# Altium schematic sheet POWER.schdoc
size D; SheetNumber: 8; SheetTotal: 8
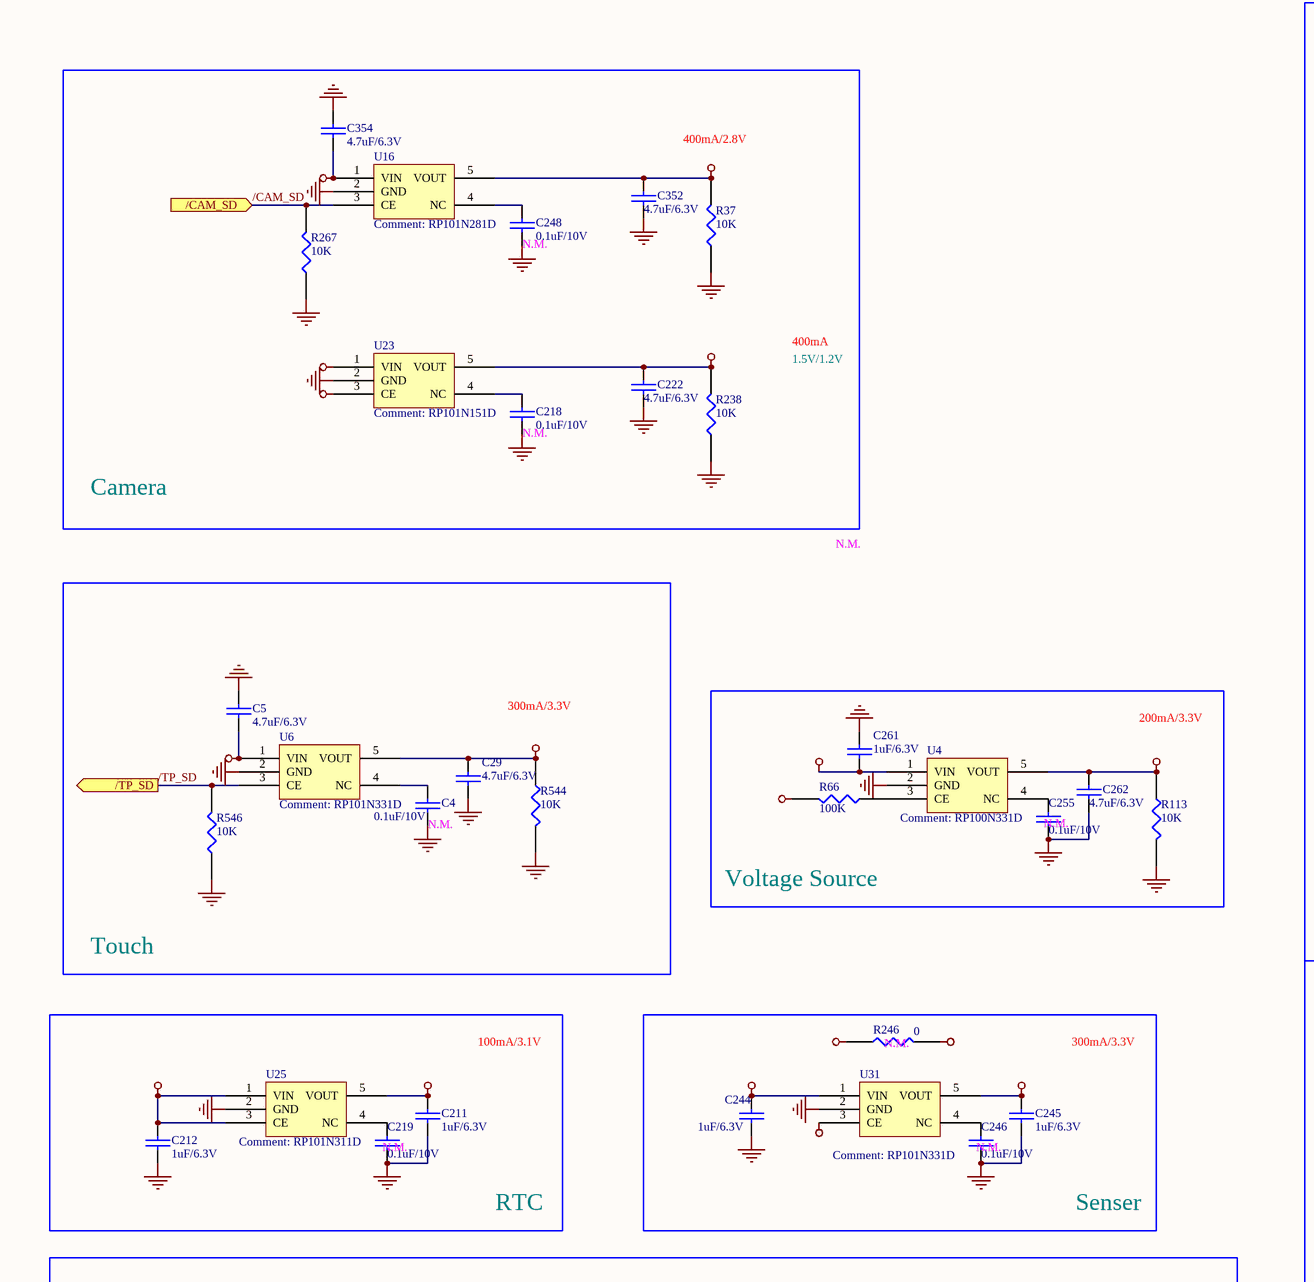
[diagram p0: POWER.schdoc, top left]
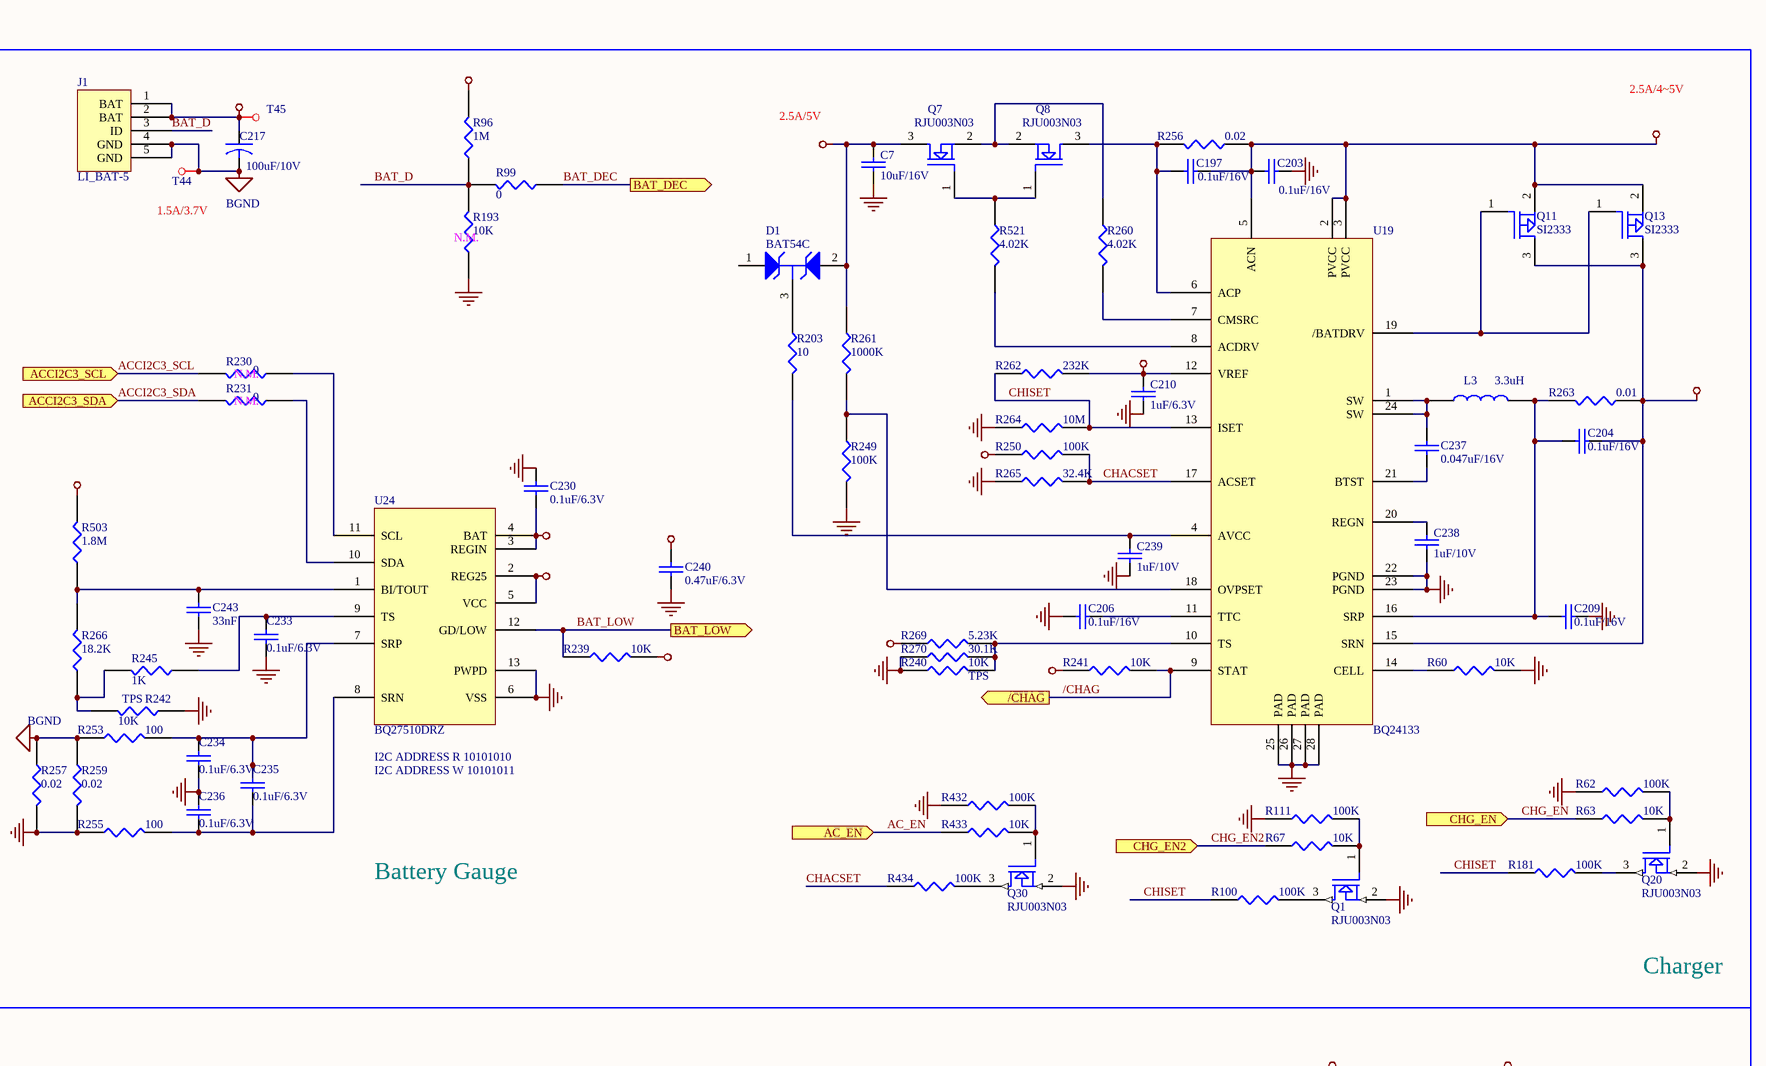
[diagram p1: POWER.schdoc, top middle]
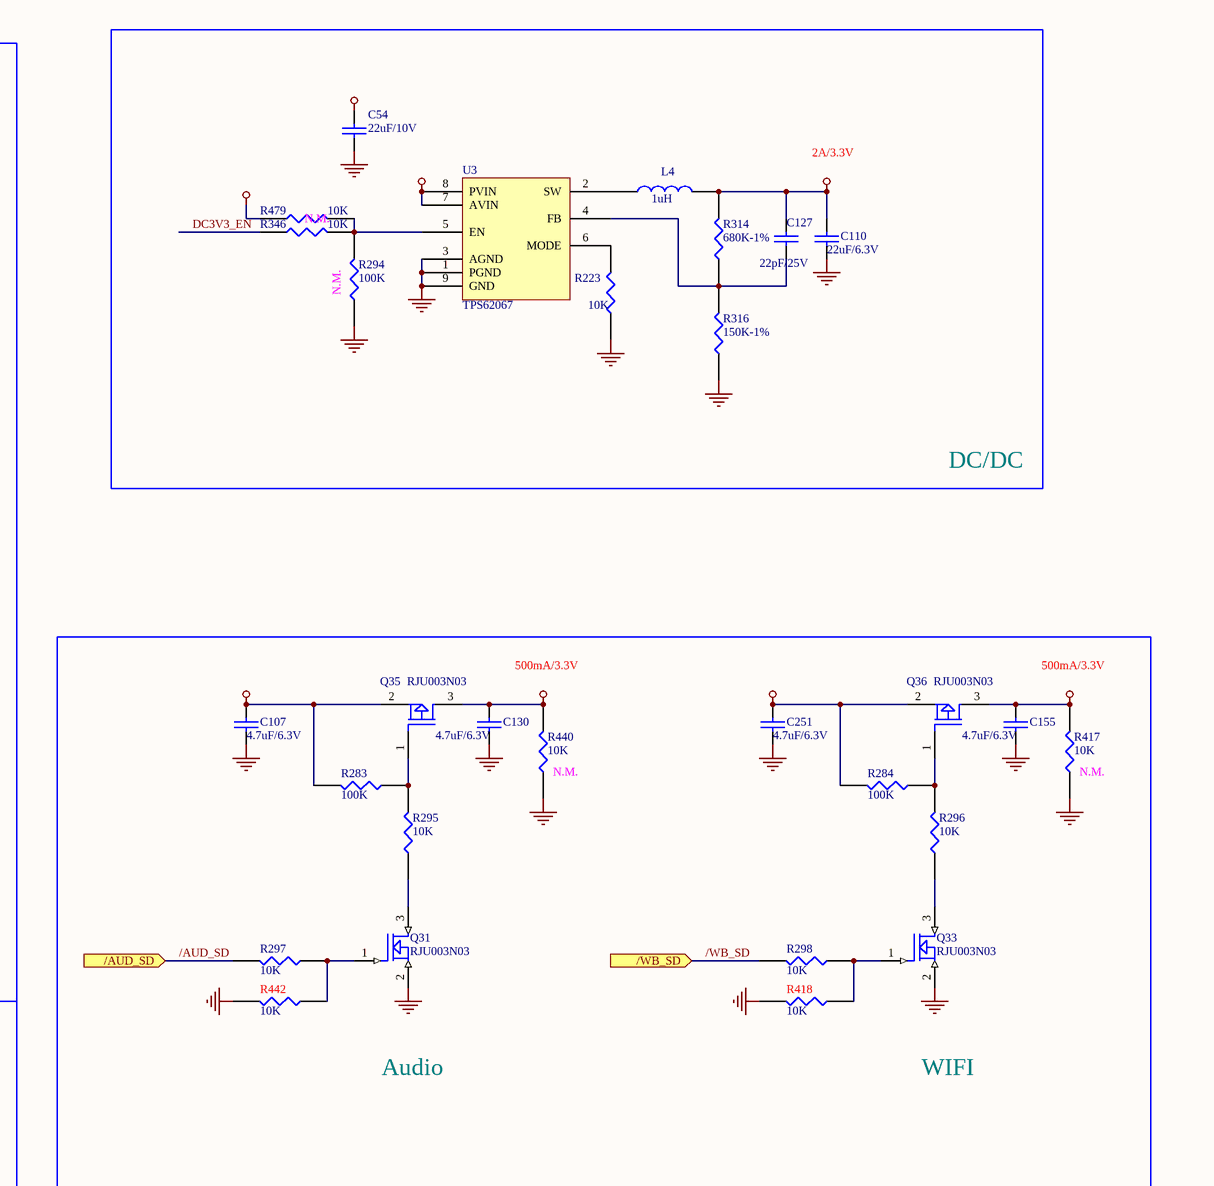
[diagram p2: POWER.schdoc, top right]
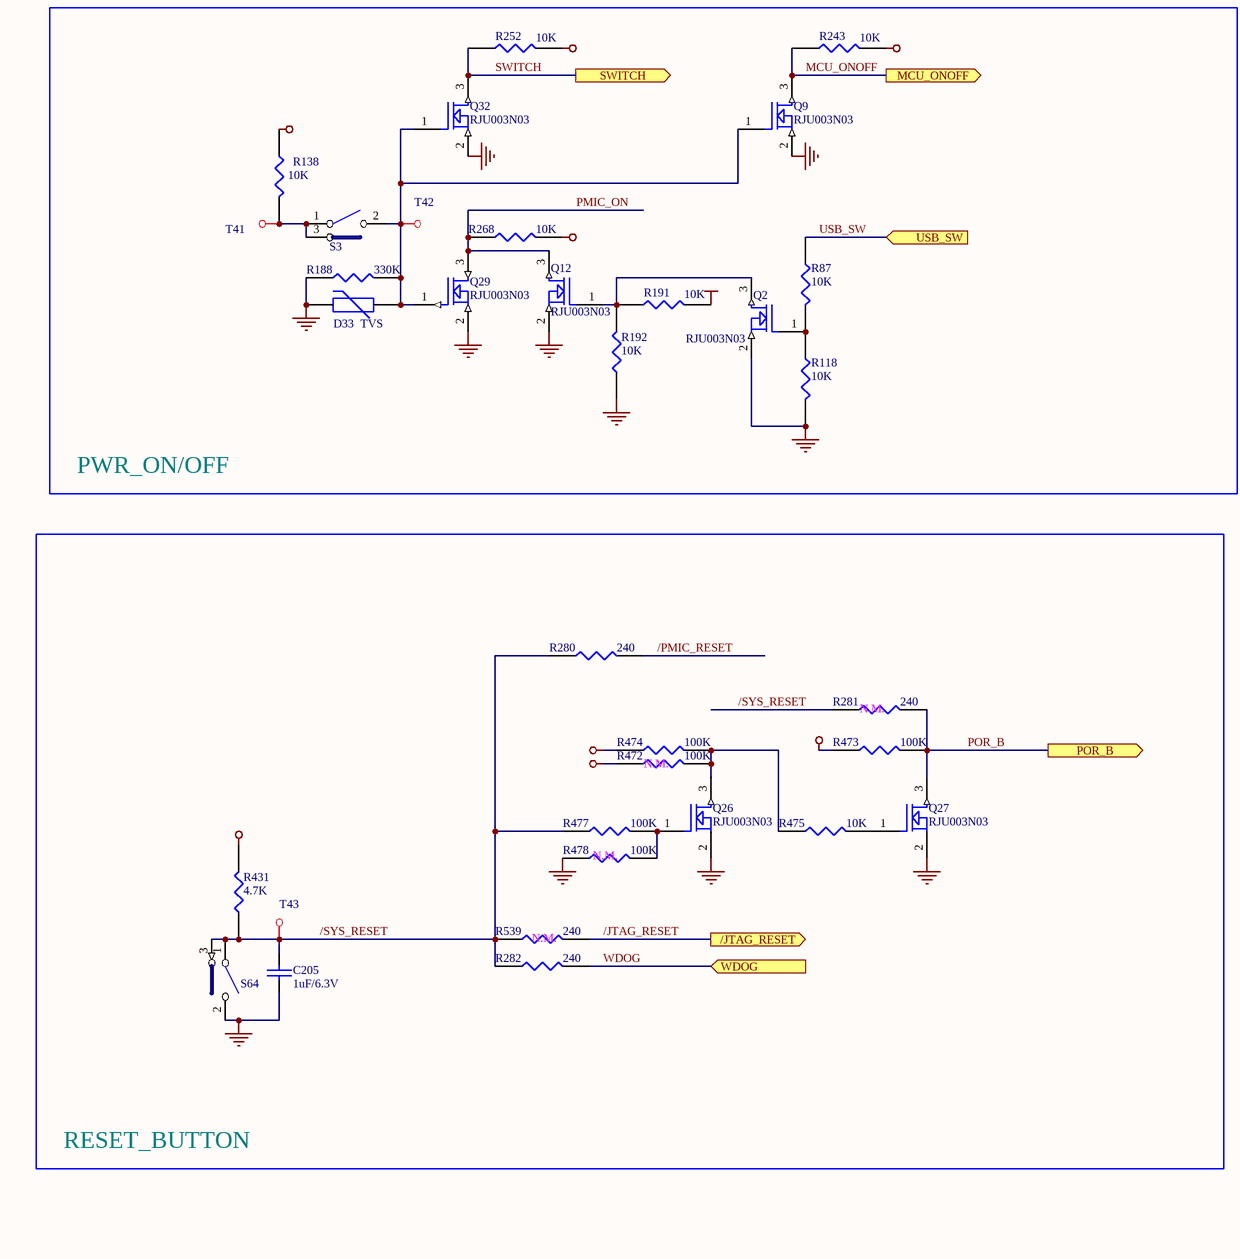
[diagram p3: POWER.schdoc, bottom left]
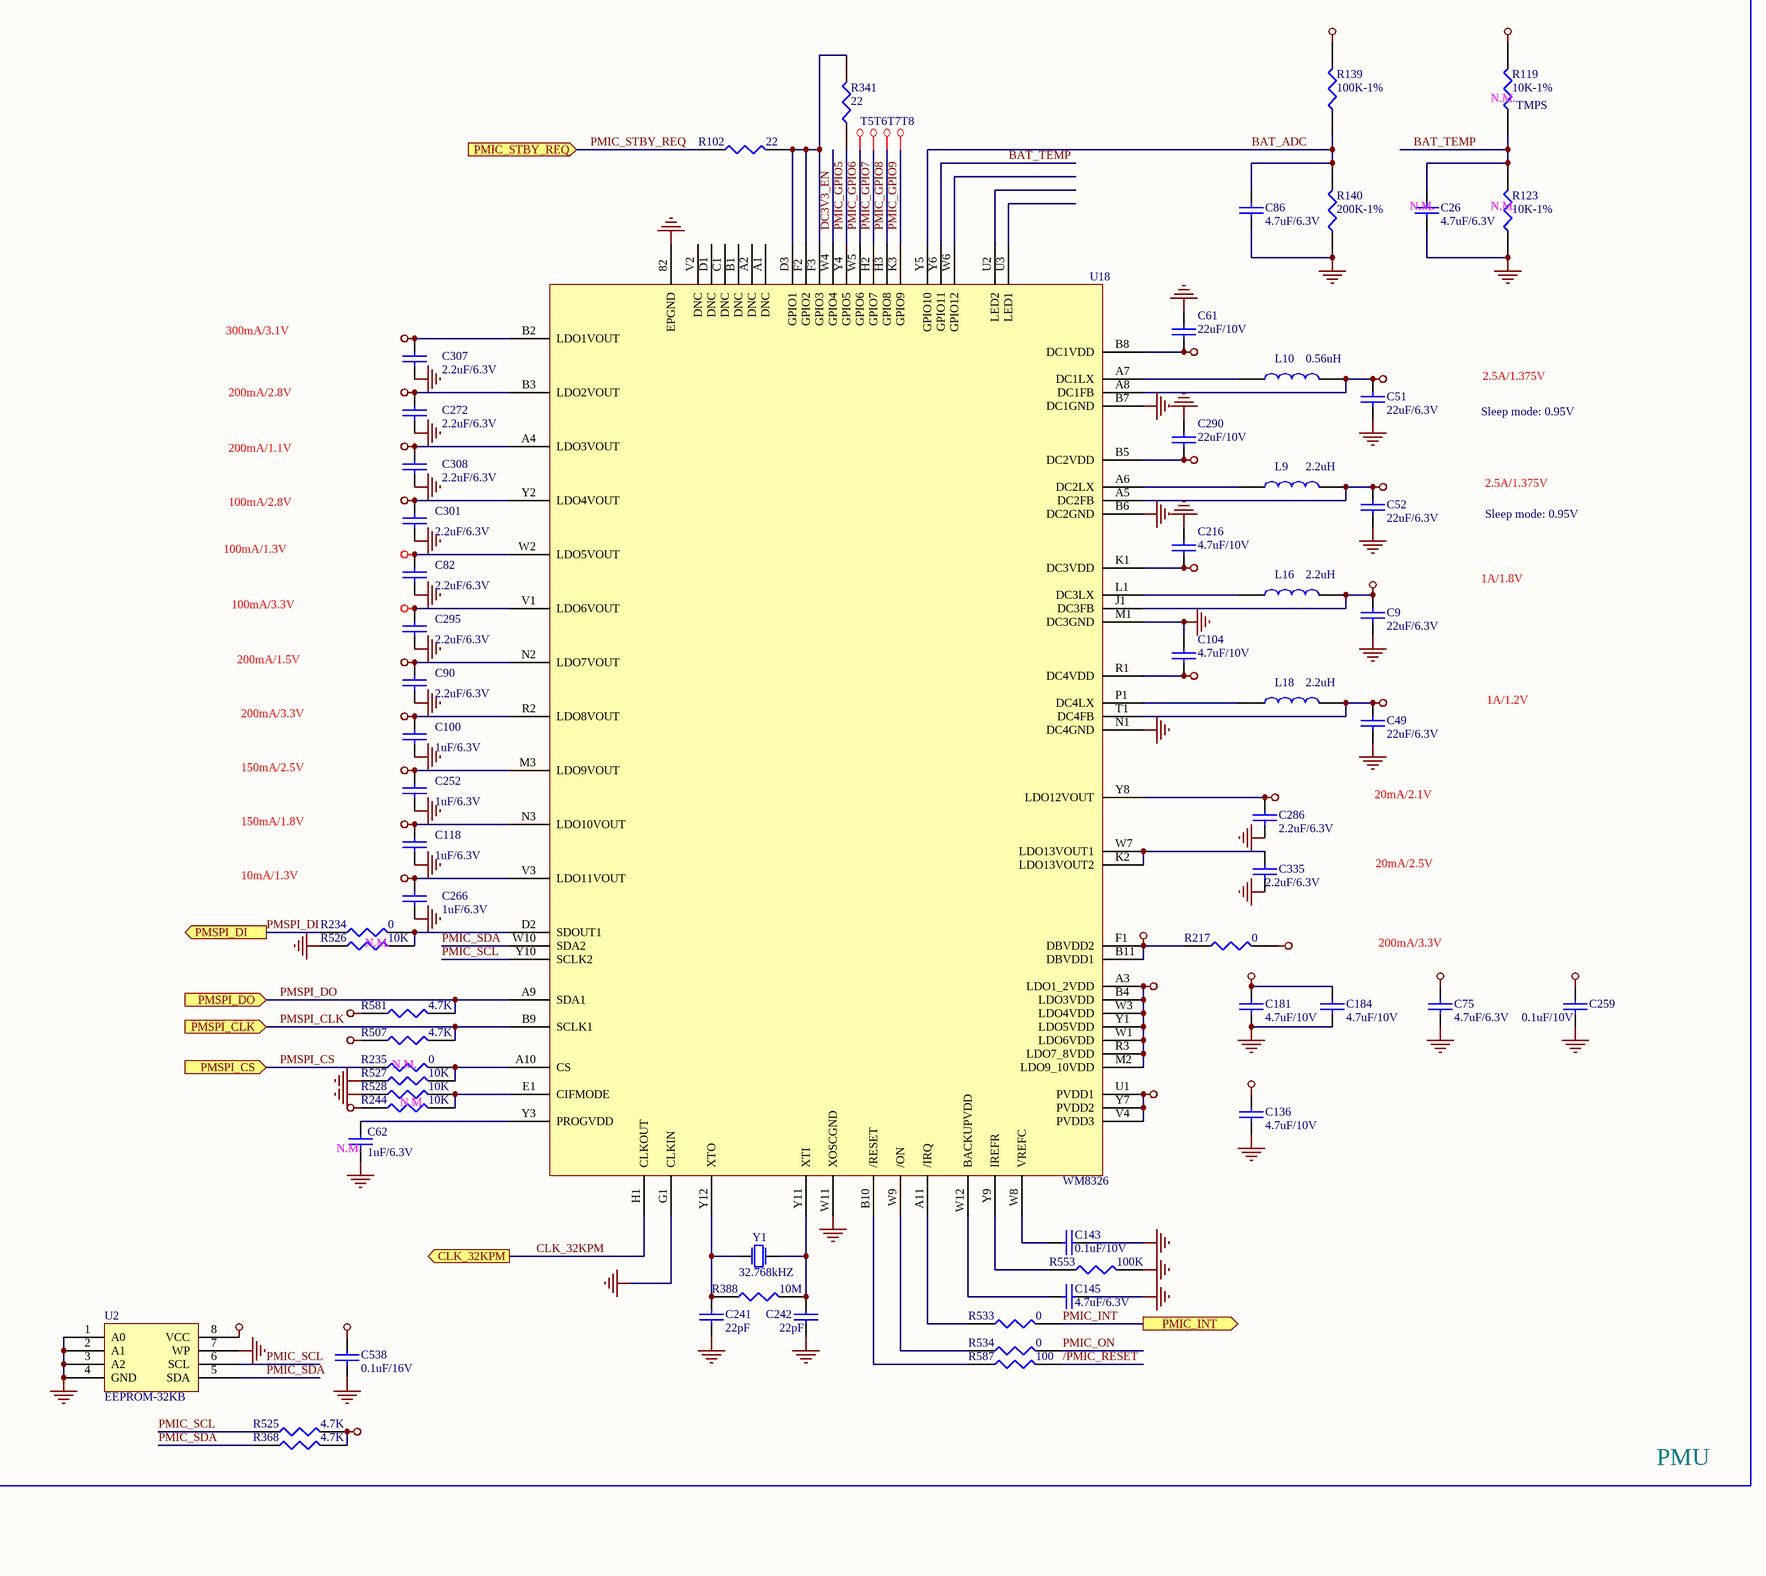
[diagram p4: POWER.schdoc, bottom middle]
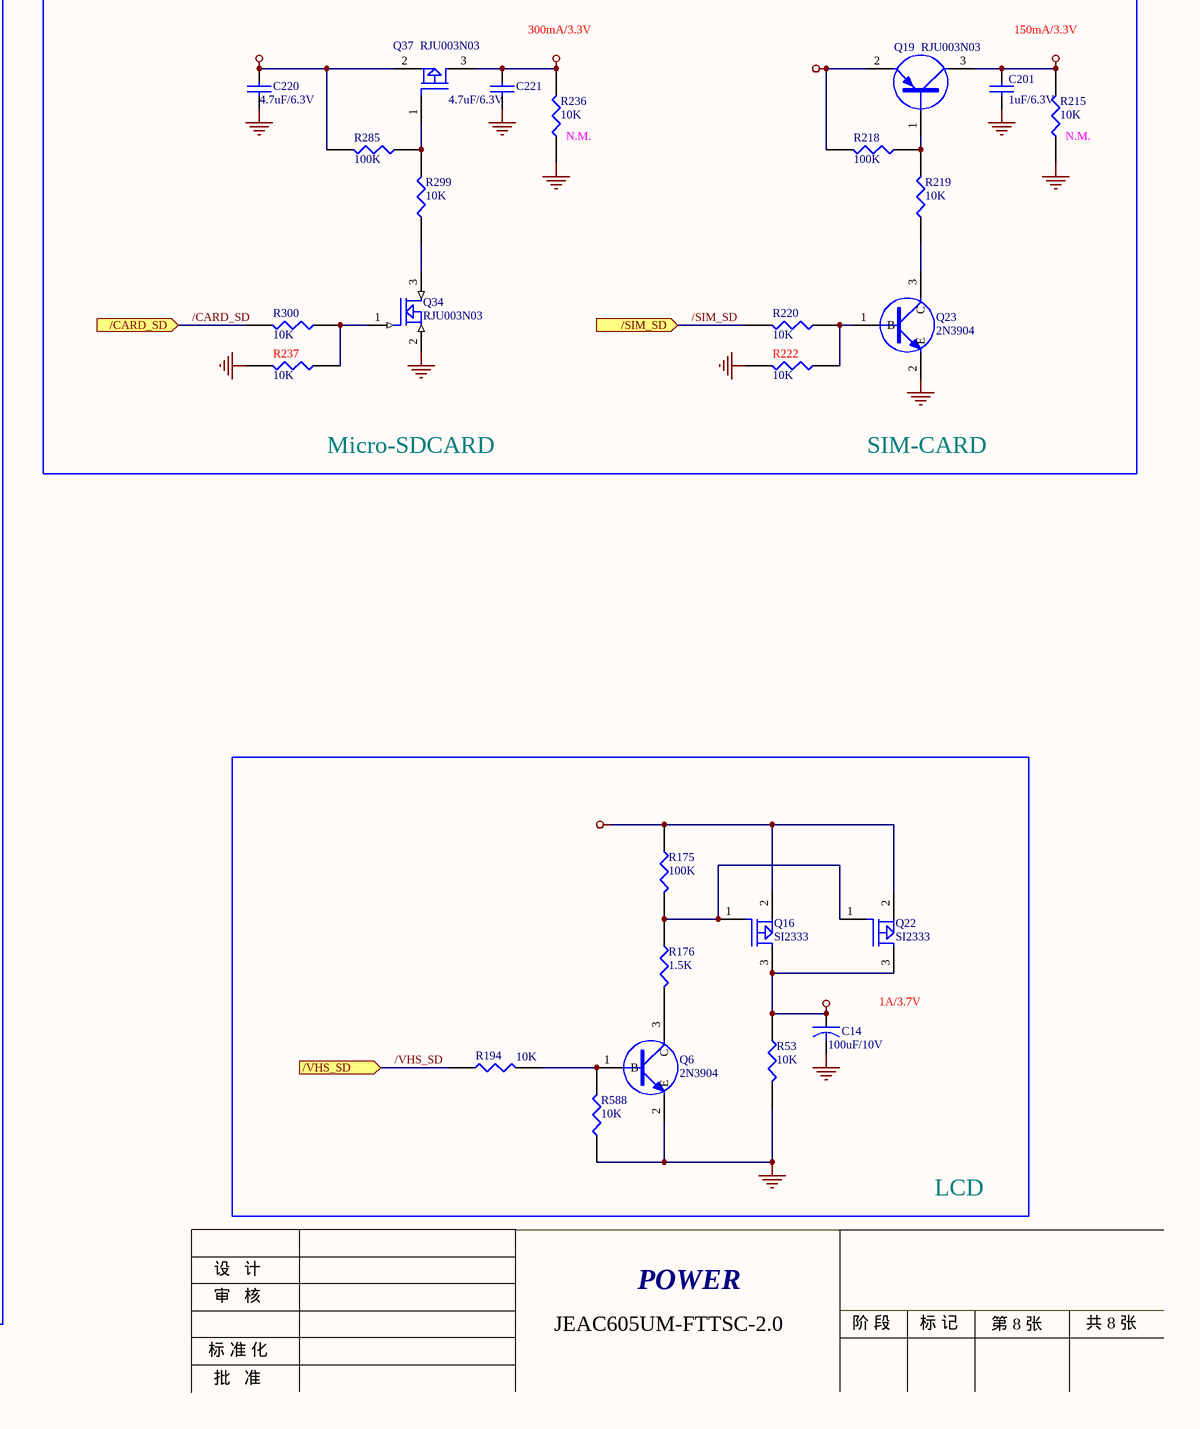
[diagram p5: POWER.schdoc, bottom right]

## Parts
C4  0.1uF/10V  [C0402]
C5  4.7uF/6.3V  [C0603]
C7  10uF/16V  [C1206]
C9  22uF/6.3V  [C0805]
C14  100uF/10V  [CASE-B]
C26  4.7uF/6.3V  [C0603]
C29  4.7uF/6.3V  [C0603]
C49  22uF/6.3V  [C0805]
C51  22uF/6.3V  [C0805]
C52  22uF/6.3V  [C0805]
C54  22uF/10V  [C0805]
C61  22uF/10V  [C0805]
C62  1uF/6.3V  [C0402]
C75  4.7uF/6.3V  [C0603]
C82  2.2uF/6.3V  [C0603]
C86  4.7uF/6.3V  [C0603]
C90  2.2uF/6.3V  [C0603]
C100  1uF/6.3V  [C0402]
C104  4.7uF/10V  [C0603]
C107  4.7uF/6.3V  [C0603]
C110  22uF/6.3V  [C0805]
C118  1uF/6.3V  [C0402]
C127  22pF/25V  [C0402]
C130  4.7uF/6.3V  [C0603]
C136  4.7uF/10V  [C0603]
C143  0.1uF/10V  [C0402]
C145  4.7uF/6.3V  [C0603]
C155  4.7uF/6.3V  [C0603]
C181  4.7uF/10V  [C0603]
C184  4.7uF/10V  [C0603]
C197  0.1uF/16V  [C0402]
C201  1uF/6.3V  [C0402]
C203  0.1uF/16V  [C0402]
C204  0.1uF/16V  [C0402]
C205  1uF/6.3V  [C0603]
C206  0.1uF/16V  [C0402]
C209  0.1uF/16V  [C0402]
C210  1uF/6.3V  [C0402]
C211  1uF/6.3V  [C0402]
C212  1uF/6.3V  [C0402]
C216  4.7uF/10V  [C0603]
C217  100uF/10V  [CASE-B]
C218  0.1uF/10V  [C0402]
C219  0.1uF/10V  [C0402]
C220  4.7uF/6.3V  [C0603]
C221  4.7uF/6.3V  [C0603]
C222  4.7uF/6.3V  [C0603]
C230  0.1uF/6.3V  [C0402]
C233  0.1uF/6.3V  [C0402]
C234  0.1uF/6.3V  [C0402]
C235  0.1uF/6.3V  [C0402]
C236  0.1uF/6.3V  [C0402]
C237  0.047uF/16V  [C0402]
C238  1uF/10V  [C0603]
C239  1uF/10V  [C0603]
C240  0.47uF/6.3V  [C0402]
C241  22pF  [C0402]
C242  22pF  [C0402]
C243  33nF  [C0402]
C244  1uF/6.3V  [C0402]
C245  1uF/6.3V  [C0402]
C246  0.1uF/10V  [C0402]
C248  0.1uF/10V  [C0402]
C251  4.7uF/6.3V  [C0603]
C252  1uF/6.3V  [C0402]
C255  0.1uF/10V  [C0402]
C259  0.1uF/10V  [C0402]
C261  1uF/6.3V  [C0402]
C262  4.7uF/6.3V  [C0603]
C266  1uF/6.3V  [C0402]
C272  2.2uF/6.3V  [C0603]
C286  2.2uF/6.3V  [C0603]
C290  22uF/10V  [C0805]
C295  2.2uF/6.3V  [C0603]
C301  2.2uF/6.3V  [C0603]
C307  2.2uF/6.3V  [C0603]
C308  2.2uF/6.3V  [C0603]
C335  2.2uF/6.3V  [C0603]
C352  4.7uF/6.3V  [C0603]
C354  4.7uF/6.3V  [C0603]
C538  0.1uF/16V  [C0402]
D1  BAT54C  [SOT-23]
D33  TVS  [D06342]
J1  LI_BAT-5  [J-BAT-5-1_25]
L3  3.3uH  [L-2-2_7]
L4  1uH  [l-2-EIA1008]
L9  2.2uH  [l-2-EIA1008]
L10  0.56uH  [l-2-EIA1008]
L16  2.2uH  [l-2-EIA1008]
L18  2.2uH  [l-2-EIA1008]
Q1  RJU003N03  [SOT-23-NPN]
Q2  RJU003N03  [SOT-23-NPN]
Q6  2N3904  [SOT-23-NPN]
Q7  RJU003N03  [SOT-23-NPN]
Q8  RJU003N03  [SOT-23-NPN]
Q9  RJU003N03  [SOT-23-NPN]
Q11  SI2333  [SOT-23]
Q12  RJU003N03  [SOT-23-NPN]
Q13  SI2333  [SOT-23]
Q16  SI2333  [SOT-23]
Q19  RJU003N03  [SOT-23-PNP]
Q20  RJU003N03  [SOT-23-NPN]
Q22  SI2333  [SOT-23]
Q23  2N3904  [SOT-23-NPN]
Q26  RJU003N03  [SOT-23-NPN]
Q27  RJU003N03  [SOT-23-NPN]
Q29  RJU003N03  [SOT-23-NPN]
Q30  RJU003N03  [SOT-23-NPN]
Q31  RJU003N03  [SOT-23-NPN]
Q32  RJU003N03  [SOT-23-NPN]
Q33  RJU003N03  [SOT-23-NPN]
Q34  RJU003N03  [SOT-23-NPN]
Q35  RJU003N03  [SOT-23]
Q36  RJU003N03  [SOT-23]
Q37  RJU003N03  [SOT-23]
R37  10K  [R0402]
R53  10K  [R0402]
R60  10K  [R0402]
R62  100K  [R0402]
R63  10K  [R0402]
R66  100K  [R0402]
R67  10K  [R0402]
R87  10K  [R0402]
R96  1M  [R0402]
R99  0  [R0402]
R100  100K  [R0402]
R102  22  [R0402]
R111  100K  [R0402]
R113  10K  [R0402]
R118  10K  [R0402]
R119  10K-1%  [R0603]
R123  10K-1%  [R0402]
R138  10K  [R0402]
R139  100K-1%  [R0402]
R140  200K-1%  [R0402]
R175  100K  [R0402]
R176  1.5K  [R0402]
R181  100K  [R0402]
R188  330K  [R0402]
R191  10K  [R0402]
R192  10K  [R0402]
R193  10K  [R0402]
R194  10K  [R0402]
R203  10  [R0402]
R215  10K  [R0402]
R217  0  [R0402]
R218  100K  [R0402]
R219  10K  [R0402]
R220  10K  [R0402]
R222  10K  [R0402]
R223  10K  [R0402]
R230  0  [R0402]
R231  0  [R0402]
R234  0  [R0402]
R235  0  [R0402]
R236  10K  [R0402]
R237  10K  [R0402]
R238  10K  [R0402]
R239  10K  [R0603]
R240  10K  [R0603]
R241  10K  [R0603]
R242  10K  [R0603]
R243  10K  [R0402]
R244  10K  [R0402]
R245  1K  [R0402]
R246  0  [R0402]
R249  100K  [R0402]
R250  100K  [R0402]
R252  10K  [R0402]
R253  100  [R0603]
R255  100  [R0603]
R256  0.02  [R0805]
R257  0.02  [R0603]
R259  0.02  [R0603]
R260  4.02K  [R0402]
R261  1000K  [R0402]
R262  232K  [R0402]
R263  0.01  [R0805]
R264  10M  [R0402]
R265  32.4K  [R0402]
R266  18.2K  [R0402]
R267  10K  [R0402]
R268  10K  [R0402]
R269  5.23K  [R0402]
R270  30.1K  [R0402]
R280  240  [R0402]
R281  240  [R0402]
R282  240  [R0402]
R283  100K  [R0402]
R284  100K  [R0402]
R285  100K  [R0402]
R294  100K  [R0402]
R295  10K  [R0402]
R296  10K  [R0402]
R297  10K  [R0402]
R298  10K  [R0402]
R299  10K  [R0402]
R300  10K  [R0402]
R314  680K-1%  [R0402]
R316  150K-1%  [R0402]
R341  22  [R0402]
R346  10K  [R0402]
R368  4.7K  [R0402]
R388  10M  [R0402]
R417  10K  [R0402]
R418  10K  [R0402]
R431  4.7K  [R0402]
R432  100K  [R0402]
R433  10K  [R0402]
R434  100K  [R0402]
R440  10K  [R0402]
R442  10K  [R0402]
R472  100K  [R0402]
R473  100K  [R0402]
R474  100K  [R0402]
R475  10K  [R0402]
R477  100K  [R0402]
R478  100K  [R0402]
R479  10K  [R0402]
R503  1.8M  [R0402]
R507  4.7K  [R0402]
R521  4.02K  [R0402]
R525  4.7K  [R0402]
R526  10K  [R0402]
R527  10K  [R0402]
R528  10K  [R0402]
R533  0  [R0402]
R534  0  [R0402]
R539  240  [R0402]
R544  10K  [R0402]
R546  10K  [R0402]
R553  100K  [R0402]
R581  4.7K  [R0402]
R587  100  [R0402]
R588  10K  [R0402]
S3  SW SPST_side  [J-SW-3-1_225]  (value not drawn)
S64  SW SPST_side  [J-SW-3-1_225]  (value not drawn)
T5  Testpoint  [TP0_5]  (value not drawn)
T6  Testpoint  [TP0_5]  (value not drawn)
T7  Testpoint  [TP0_5]  (value not drawn)
T8  Testpoint  [TP0_5]  (value not drawn)
T41  Testpoint  [TP2_0]  (value not drawn)
T42  Testpoint  [TP2_0]  (value not drawn)
T43  Testpoint  [TP2_0]  (value not drawn)
T44  Testpoint  [TP2_0]  (value not drawn)
T45  Testpoint  [TP2_0]  (value not drawn)
U2  EEPROM-32KB  [U-SO-8-1_27]
U3  TPS62067  [U-QFN-8-0_5]
U4  RP100N331D  [SOT23-5-0_95]
U6  RP101N331D  [SOT23-5-0_95]
U16  RP101N281D  [SOT23-5-0_95]
U18  WM8326  [U-WM-81-8325]
U19  BQ24133  [U-DQFN-24-0_5]
U23  RP101N151D  [SOT23-5-0_95]
U24  BQ27510DRZ  [U-SON-12-0_4]
U25  RP101N311D  [SOT23-5-0_95]
U31  RP101N331D  [SOT23-5-0_95]
Y1  32.768kHZ  [Y-2-XTALB]

## Blocks framed on the sheet
DC/DC: C54 C110 C127 L4 R223 R294 R314 R316 R346 R479 U3
Camera: C218 C222 C248 C352 C354 R37 R238 R267 U16 U23
Touch: C4 C5 C29 R544 R546 U6
Voltage Source: C255 C261 C262 R66 R113 U4
RTC: C211 C212 C219 U25
Senser: C244-C246 R246 U31
PWR_ON/OFF: D33 Q2 Q9 Q12 Q29 Q32 R87 R118 R138 R188 R191 R192 R243 R252 R268 S3 T41 T42
RESET_BUTTON: C205 Q26 Q27 R280-R282 R431 R472-R475 R477 R478 R539 S64 T43
LCD: C14 Q6 Q16 Q22 R53 R175 R176 R194 R588

## Ports
/AUD_SD (in), /CAM_SD (in), /CARD_SD (in), /CHAG (out), /JTAG_RESET (out), /SIM_SD (in), /TP_SD (out), /VHS_SD (in), /WB_SD (in), AC_EN (in), ACCI2C3_SCL (in), ACCI2C3_SDA (in), BAT_DEC (out), BAT_LOW (out), CHG_EN2 (in), CHG_EN (in), CLK_32KPM (out), MCU_ONOFF (out), PMIC_INT (out), PMIC_STBY_REQ (in), PMSPI_CLK (in), PMSPI_CS (in), PMSPI_DI (out), PMSPI_DO (in), POR_B (out), SWITCH (out), USB_SW (in), WDOG (in)

## Nets
BGND: C217.2 J1.4(GND) J1.5(GND) R253.1 R257.1 R259.1 T44.1(TP)
CHVREF: C210.1 R250.1 R262.2 R269.1 U19.12(VREF)
GND: C4.2 C5.2 C7.2 C9.2 C14.2 C26.1 C29.2 C49.2 C51.2 C52.2 C54.2 C61.1 C62.2 C75.2 C82.2 C86.1 C90.2 C100.2 C104.1 C107.2 C110.2 C118.2 C130.1 C136.2 C143.2 C145.2 C155.1 C181.2 C184.2 C201.2 C203.2 C205.1 C206.1 C209.2 C210.2 C211.2 C212.2 C216.1 C218.2 C219.2 C220.2 C221.1 C222.1 C230.2 C233.2 C234.2 C236.1 C238.2 C239.2 C240.2 C241.1 C242.1 C243.2 C244.2 C245.2 C246.2 C248.2 C251.2 C252.2 C255.2 C259.2 C261.2 C262.2 C266.2 C272.2 C286.2 C290.1 C295.2 C301.2 C307.2 C308.2 C335.1 C352.1 C354.2 C538.1 D33.2 J1.6(GND) J1.7(GND) Q1.2(S) Q2.2(S) Q6.2(E) Q9.2(S) Q12.2(S) Q20.2(S) Q23.2(E) Q26.2(S) Q27.2(S) Q29.2(S) Q30.2(S) Q31.2(S) Q32.2(S) Q33.2(S) Q34.2(S) R37.1 R53.2 R60.2 R62.1 R111.1 R113.2 R118.2 R123.1 R140.1 R188.1 R192.1 R193.1 R215.1 R222.2 R223.1 R236.1 R237.2 R238.1 R240.1 R242.1 R249.2 R255.1 R257.2 R259.2 R264.1 R265.1 R267.1 R270.1 R294.1 R316.1 R417.1 R418.2 R432.1 R440.1 R442.2 R478.1 R526.1 R527.1 R528.1 R544.2 R546.1 R553.2 R588.1 S3.6(GND) S3.7(GND) S64.2(NO) S64.6(GND) S64.7(GND) U2.1(A0) U2.2(A1) U2.3(A2) U2.4(GND) U2.7(WP) U3.1(PGND) U3.3(AGND) U3.9(GND) U4.2(GND) U6.2(GND) U16.2(GND) U18.82(EPGND) U18.B6(DC2GND) U18.B7(DC1GND) U18.G1(CLKIN) U18.M1(DC3GND) U18.N1(DC4GND) U18.W11(XOSCGND) U19.22(PGND) U19.23(PGND) U19.25(PAD) U19.26(PAD) U19.27(PAD) U19.28(PAD) U23.2(GND) U24.6(VSS) U24.13(PWPD) U25.2(GND) U31.2(GND)
LDO_1V3: C82.1 U18.W2(LDO5VOUT)
LDO_1V8: C118.1 U18.N3(LDO10VOUT)
LDO_2V5: C252.1 U18.M3(LDO9VOUT)
LDO_3V3: C295.1 U18.V1(LDO6VOUT)
LDO_RTC: C266.1 U18.V3(LDO11VOUT)
USB_BUSIN: R191.2
V_HS: C14.1 Q16.3(D) Q22.3(D) R53.1
VBUS: C7.1 D1.2(K) Q7.3(D) R261.1
VCC_1V1: C308.1 U18.A4(LDO3VOUT)
VCC_1V5: C90.1 U18.N2(LDO7VOUT)
VCC_1V8: C9.1 L16.2 U18.J1(DC3FB)
VCC_2V8: C272.1 U18.B3(LDO2VOUT)
VCC_3V: C107.1 C110.1 C127.2 C220.1 C251.1 L4.2 Q19.2(E) Q35.2(S) Q36.2(S) Q37.2(S) R66.2 R96.2 R218.2 R239.2 R241.1 R252.2 R283.2 R284.2 R285.2 R314.2 R431.2 R472.1
VCC_3V1: C307.1 R479.1 U18.B2(LDO1VOUT)
VCC_CAM: C352.2 R37.2 U16.5(VOUT) U23.1(VIN) U23.3(CE)
VCC_CAMD: C222.2 R238.2 U23.5(VOUT)
VCC_CARD: C221.2 Q37.3(D) R236.2
VCC_MEMS: C245.1 R246.2 U31.5(VOUT)
VCC_MEMS1: C100.1 R246.1 U18.R2(LDO8VOUT) U31.3(CE)
VCC_MIPIB: C301.1 U18.Y2(LDO4VOUT)
VCC_MP3: C130.2 Q35.3(D) R440.2
VCC_SIM: C201.1 Q19.3(C) R215.2
VCC_TOUCH: C29.1 R544.1 U6.5(VOUT)
VDD_ARM_IN: C52.1 L9.2 U18.A5(DC2FB)
VDD_BASIC: C259.1 C262.1 R113.1 R217.2 U4.5(VOUT)
VDD_DBVDD: C75.1 R119.2 R217.1 R507.1 R581.1 U18.B11(DBVDD1) U18.F1(DBVDD2)
VDD_REG25: C240.1 R503.2 U24.2(REG25) U24.5(VCC)
VDD_SDR_1.2V: C49.1 L18.2 U18.T1(DC4FB)
VDD_SNVS_IN: R243.2 R473.1 R474.1
VDD_SOC_IN: C51.1 L10.2 U18.A8(DC1FB)
VDD_SRTC_MX: C211.1 U25.5(VOUT)
VDD_VPMIC: C286.1 C538.2 R138.1 R268.2 R368.2 R525.2 U2.8(VCC) U18.Y8(LDO12VOUT)
VDD_WB33: C155.2 Q36.3(D) R417.2
VLI_BAT: C204.2 C217.1 C230.1 J1.1(BAT) J1.2(BAT) Q11.3(D) Q13.3(D) R139.2 R263.1 T45.1(TP) U19.15(SRN) U24.3(REGIN) U24.4(BAT)
VMAX: C5.1 C54.1 C61.2 C104.2 C136.1 C181.1 C184.1 C197.2 C203.1 C212.1 C216.2 C244.1 C261.1 C290.2 C354.1 Q11.2(S) Q13.2(S) Q16.2(S) Q22.2(S) R175.1 R244.1 R256.1 U3.7(AVIN) U3.8(PVIN) U4.1(VIN) U6.1(VIN) U16.1(VIN) U18.A3(LDO1_2VDD) U18.B4(LDO3VDD) U18.B5(DC2VDD) U18.B8(DC1VDD) U18.K1(DC3VDD) U18.M2(LDO9_10VDD) U18.R1(DC4VDD) U18.R3(LDO7_8VDD) U18.U1(PVDD1) U18.V4(PVDD3) U18.W1(LDO6VDD) U18.W3(LDO4VDD) U18.Y1(LDO5VDD) U18.Y7(PVDD2) U19.2(PVCC) U19.3(PVCC) U19.5(ACN) U25.1(VIN) U25.3(CE) U31.1(VIN)
/AUD_SD: R297.2 ; port /AUD_SD
/CAM_SD: R267.2 U16.3(CE) ; port /CAM_SD
/CARD_SD: R300.2 ; port /CARD_SD
/CHAG: R241.2 U19.9(STAT) ; port /CHAG
/JTAG_RESET: R539.2 ; port /JTAG_RESET
/PMIC_RESET: R280.2 R587.2
/SIM_SD: R220.2 ; port /SIM_SD
/SYS_RESET: C205.2 R280.1 R281.1 R282.1 R431.1 R477.1 R539.1 S64.1(COMMON) S64.3(COMMON) T43.1(TP)
/TP_SD: R546.2 U6.3(CE) ; port /TP_SD
/VHS_SD: R194.1 ; port /VHS_SD
/WB_SD: R298.2 ; port /WB_SD
AC_EN: R433.1 ; port AC_EN
ACCI2C3_SCL: R230.2 ; port ACCI2C3_SCL
ACCI2C3_SDA: R231.2 ; port ACCI2C3_SDA
BAT_ADC: C86.2 R139.1 R140.2 U18.Y5(GPIO10)
BAT_D: J1.3(ID) R96.1 R99.2 R193.2
BAT_DEC: R99.1 ; port BAT_DEC
BAT_LOW: R239.1 U24.12(GD/LOW) ; port BAT_LOW
BAT_TEMP: C26.2 R119.1 R123.2 U18.Y6(GPIO11)
CHACSET: R250.2 R265.2 R434.1 U19.17(ACSET)
CHG_EN: R63.1 ; port CHG_EN
CHG_EN2: R67.1 ; port CHG_EN2
CHISET: R100.1 R181.1 R262.1 R264.2 U19.13(ISET)
CLK_32KPM: U18.H1(CLKOUT) ; port CLK_32KPM
DC3V3_EN: R346.1 U18.W4(GPIO4)
MCU_ONOFF: Q9.3(D) R243.1 ; port MCU_ONOFF
PMIC_GPIO5: R341.1 U18.Y4(GPIO5)
PMIC_GPIO6: T5.1(TP) U18.W5(GPIO6)
PMIC_GPIO7: T6.1(TP) U18.H2(GPIO7)
PMIC_GPIO8: T7.1(TP) U18.H3(GPIO8)
PMIC_GPIO9: T8.1(TP) U18.K3(GPIO9)
PMIC_INT: R533.2 ; port PMIC_INT
PMIC_ON: Q12.3(D) Q29.3(D) R268.1 R534.2
PMIC_SCL: R525.1 U2.6(SCL) U18.Y10(SCLK2)
PMIC_SDA: R368.1 U2.5(SDA) U18.W10(SDA2)
PMIC_STBY_REQ: R102.1 ; port PMIC_STBY_REQ
PMSPI_CLK: R507.2 U18.B9(SCLK1) ; port PMSPI_CLK
PMSPI_CS: R235.1 ; port PMSPI_CS
PMSPI_DI: R234.1 ; port PMSPI_DI
PMSPI_DO: R581.2 U18.A9(SDA1) ; port PMSPI_DO
POR_B: Q27.3(D) R281.2 R473.2 ; port POR_B
SWITCH: Q32.3(D) R252.1 ; port SWITCH
USB_SW: R87.1 ; port USB_SW
WDOG: R282.2 ; port WDOG
NetC4_1: C4.1 U6.4(NC)
NetC62_1: C62.1 U18.Y3(PROGVDD)
NetC127_1: C127.1 R314.1 R316.2 U3.4(FB)
NetC143_1: C143.1 U18.W8(VREFC)
NetC145_1: C145.1 U18.W12(BACKUPVDD)
NetC197_1: C197.1 Q8.3(D) R256.2 U19.6(ACP)
NetC204_1: C204.1 C209.1 L3.2 R263.2 U19.16(SRP)
NetC206_2: C206.2 U19.11(TTC)
NetC218_1: C218.1 U23.4(NC)
NetC219_1: C219.1 U25.4(NC)
NetC233_1: C233.1 R245.1 U24.9(TS)
NetC234_1: C234.1 C235.1 R253.2 U24.7(SRP)
NetC235_2: C235.2 C236.2 R255.2 U24.8(SRN)
NetC237_1: C237.1 L3.1 U19.1(SW) U19.24(SW)
NetC237_2: C237.2 U19.21(BTST)
NetC238_1: C238.1 U19.20(REGN)
NetC239_1: C239.1 R203.2 U19.4(AVCC)
NetC241_2: C241.2 R388.1 U18.Y12(XTO) Y1.1(P1)
NetC242_2: C242.2 R388.2 U18.Y11(XTI) Y1.2(P2)
NetC243_1: C243.1 R266.2 R503.1 U24.1(BI/TOUT)
NetC246_1: C246.1 U31.4(NC)
NetC248_1: C248.1 U16.4(NC)
NetC255_1: C255.1 U4.4(NC)
NetC335_2: C335.2 U18.K2(LDO13VOUT2) U18.W7(LDO13VOUT1)
NetD1_3: D1.3(A) R203.1
NetD33_1: D33.1 Q9.1(G) Q29.1(G) Q32.1(G) R188.2 S3.2(NO) T42.1(TP)
NetL4_1: L4.1 U3.2(SW)
NetL9_1: L9.1 U18.A6(DC2LX)
NetL10_1: L10.1 U18.A7(DC1LX)
NetL16_1: L16.1 U18.L1(DC3LX)
NetL18_1: L18.1 U18.P1(DC4LX)
NetQ1_1: Q1.1(G) R67.2 R111.2
NetQ1_3: Q1.3(D) R100.2
NetQ2_1: Q2.1(G) R87.2 R118.1
NetQ2_3: Q2.3(D) Q12.1(G) R191.1 R192.2
NetQ6_1: Q6.1(B) R194.2 R588.2
NetQ6_3: Q6.3(C) R176.2
NetQ7_1: Q7.1(G) Q8.1(G) R521.1
NetQ7_2: Q7.2(S) Q8.2(S) R260.1
NetQ11_1: Q11.1(G) Q13.1(G) U19.19(/BATDRV)
NetQ16_1: Q16.1(G) Q22.1(G) R175.2 R176.1
NetQ19_1: Q19.1(B) R218.1 R219.2
NetQ20_1: Q20.1(G) R62.2 R63.2
NetQ20_3: Q20.3(D) R181.2
NetQ23_1: Q23.1(B) R220.1 R222.1
NetQ23_3: Q23.3(C) R219.1
NetQ26_1: Q26.1(G) R477.2 R478.2
NetQ26_3: Q26.3(D) R472.2 R474.2 R475.1
NetQ27_1: Q27.1(G) R475.2
NetQ30_1: Q30.1(G) R432.2 R433.2
NetQ30_3: Q30.3(D) R434.2
NetQ31_1: Q31.1(G) R297.1 R442.1
NetQ31_3: Q31.3(D) R295.1
NetQ33_1: Q33.1(G) R298.1 R418.1
NetQ33_3: Q33.3(D) R296.1
NetQ34_1: Q34.1(G) R237.1 R300.1
NetQ34_3: Q34.3(D) R299.1
NetQ35_1: Q35.1(G) R283.1 R295.2
NetQ36_1: Q36.1(G) R284.1 R296.2
NetQ37_1: Q37.1(G) R285.1 R299.2
NetR60_1: R60.1 U19.14(CELL)
NetR66_1: R66.1 U4.3(CE)
NetR102_2: R102.2 R341.2 U18.D3(GPIO1) U18.F2(GPIO2) U18.F3(GPIO3)
NetR138_2: R138.2 S3.1(COMMON) S3.3(COMMON) T41.1(TP)
NetR223_2: R223.2 U3.6(MODE)
NetR230_1: R230.1 U24.11(SCL)
NetR231_1: R231.1 U24.10(SDA)
NetR234_2: R234.2 R526.2 U18.D2(SDOUT1)
NetR235_2: R235.2 R527.2 U18.A10(CS)
NetR240_2: R240.2 R269.2 R270.2 U19.10(TS)
NetR242_2: R242.2 R245.2 R266.1
NetR244_2: R244.2 R528.2 U18.E1(CIFMODE)
NetR249_1: R249.1 R261.2 U19.18(OVPSET)
NetR260_2: R260.2 U19.7(CMSRC)
NetR294_2: R294.2 R346.2 R479.2 U3.5(EN)
NetR521_2: R521.2 U19.8(ACDRV)
NetR533_1: R533.1 U18.A11(/IRQ)
NetR534_1: R534.1 U18.W9(/ON)
NetR553_1: R553.1 U18.Y9(IREFR)
NetR587_1: R587.1 U18.B10(/RESET)

Not connected (* = marked no-connect by the designer): D1 1(A); U18 A1(DNC) A2(DNC) B1(DNC) C1(DNC) D1(DNC) U2(LED2) U3(LED1) V2(DNC) W6(GPIO12)

## Notes on the sheet
- 2.5A/4~5V
- 2.5A/5V
- 400mA/2.8V
- 1.5A/3.7V
- BGND
- 2A/3.3V
- (near R193) N.M.
- (near R479) N.M.
- (near C248) N.M.
- (near R294) N.M.
- 1.5V/1.2V
- 400mA
- (near R230) N.M.
- (near R231) N.M.
- (near C218) N.M.
- N.M.
- (near R240) TPS
- 500mA/3.3V
- 300mA/3.3V
- (near R242) TPS
- I2C ADDRESS R 10101010
- 200mA/3.3V
- I2C ADDRESS W 10101011
- (near R440) N.M.
- (near R417) N.M.
- (near C4) N.M.
- (near C255) N.M.
- Battery Gauge
- Charger
- 100mA/3.1V
- (near R246) N.M.
- Audio
- WIFI
- (near R119) N.M.
- (near R119) TMPS
- (near C219) N.M.
- (near C246) N.M.
- 150mA/3.3V
- (near C26) N.M.
- (near R123) N.M.
- 300mA/3.1V
- (near R236) N.M.
- (near R215) N.M.
- 200mA/2.8V
- 2.5A/1.375V
- 200mA/1.1V
- Sleep mode: 0.95V
- 100mA/2.8V
- 100mA/1.3V
- 100mA/3.3V
- 1A/1.8V
- 200mA/1.5V
- Micro-SDCARD
- SIM-CARD
- 1A/1.2V
- 150mA/2.5V
- 20mA/2.1V
- 150mA/1.8V
- 10mA/1.3V
- 20mA/2.5V
- (near R526) N.M.
- (near R281) N.M.
- (near R472) N.M.
- (near R235) N.M.
- (near R478) N.M.
- (near R539) N.M.
- (near C62) N.M.
- 1A/3.7V
- PMU
- 设   计
- 审   核
- POWER
- 标 准 化
- 批   准
- JEAC605UM-FTTSC-2.0
- 阶 段
- 标 记
- 第 8 张
- 共 8 张

## Library data of the parts
C4 C5 C7 C9 C29 C49 C51 C52 C54 C61 C62 C82 C90 C100 C104 C107 C110 C118 C127 C130 C143 C155 C197 C201 C203 C204 C206 C209-C212 C216 C218-C222 C230 C233-C246 C248 C251 C252 C255 C259 C261 C262 C266 C272 C286 C290 C295 C301 C307 C308 C352 C354 C538 = CAP: Capacitor
C14 C217 = CAPACITOR
C26 C75 C86 C136 C145 C181 C184 C205 C335 = CAP
D33 = SFITVS: ESD protect
L3 L4 L9 L10 L16 L18 = INDUCTOR1
Q1 Q2 Q7-Q9 Q12 Q20 Q26 Q27 Q29-Q34 = MOSFET N
Q6 Q23 = NPN: NPN Transistor
Q11 Q13 Q16 Q22 Q35-Q37 = SI1021
Q19 = PNP: PNP Transistor
R37 R53 R60 R62 R63 R66 R67 R87 R96 R99 R100 R102 R111 R113 R118 R119 R123 R138-R140 R175 R176 R181 R188 R191-R194 R203 R215 R217-R220 R222 R223 R230 R231 R234-R246 R249 R250 R252 R253 R255-R257 R259-R270 R280-R285 R294-R300 R314 R316 R341 R346 R368 R388 R417 R418 R431-R434 R440 R442 R472-R475 R477-R479 R503 R507 R521 R525-R528 R533 R534 R539 R544 R546 R553 R581 R587 R588 = RES1
U2 = MIBAO
U3 = TPS62065
U4 U6 U16 U23 U25 U31 = LDO32: LDO3.2V
U18 = WM8325
Y1 = 32.768kHZ: Crystal Oscillator